# Altium schematic sheet imx8mnano_power.SchDoc
size A3; SheetNumber: 2; SheetTotal: 6
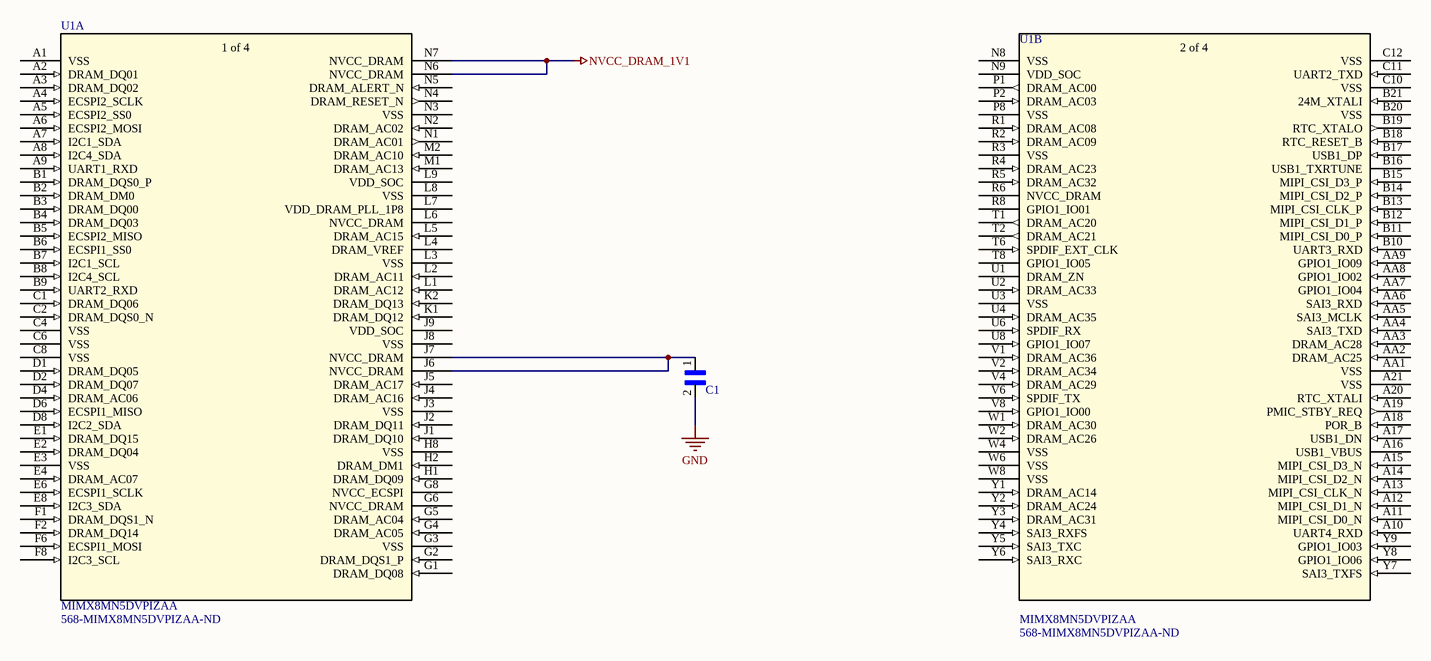
[diagram p0: imx8mnano_power.SchDoc]

## Parts
C1  CL05A106MQ5NUNC  [CL05A106MQ5NUNC]  (value not drawn)
U1  MIMX8MN5DVPIZAA  Supplier Part Number 1: 568-MIMX8MN5DVPIZAA-ND  [MIMX8MN5DVPIZAA_NXP]  (parts A,B of 4)

## Nets
GND: C1.2
NVCC_DRAM_1V1: U1.N6(NVCC_DRAM) U1.N7(NVCC_DRAM)
NetC1_1: C1.1 U1.J6(NVCC_DRAM) U1.J7(NVCC_DRAM)

Not connected (* = marked no-connect by the designer): U1 A1(VSS) A2(DRAM_DQ01) A3(DRAM_DQ02) A4(ECSPI2_SCLK) A5(ECSPI2_SS0) A6(ECSPI2_MOSI) A7(I2C1_SDA) A8(I2C4_SDA) A9(UART1_RXD) A10(UART4_RXD) A11(MIPI_CSI_D0_N) A12(MIPI_CSI_D1_N) A13(MIPI_CSI_CLK_N) A14(MIPI_CSI_D2_N) A15(MIPI_CSI_D3_N) A16(USB1_VBUS) A17(USB1_DN) A18(POR_B) A19(PMIC_STBY_REQ) A20(RTC_XTALI) A21(VSS) AA1(VSS) AA2(DRAM_AC25) AA3(DRAM_AC28) AA4(SAI3_TXD) AA5(SAI3_MCLK) AA6(SAI3_RXD) AA7(GPIO1_IO04) AA8(GPIO1_IO02) AA9(GPIO1_IO09) B1(DRAM_DQS0_P) B2(DRAM_DM0) B3(DRAM_DQ00) B4(DRAM_DQ03) B5(ECSPI2_MISO) B6(ECSPI1_SS0) B7(I2C1_SCL) B8(I2C4_SCL) B9(UART2_RXD) B10(UART3_RXD) B11(MIPI_CSI_D0_P) B12(MIPI_CSI_D1_P) B13(MIPI_CSI_CLK_P) B14(MIPI_CSI_D2_P) B15(MIPI_CSI_D3_P) B16(USB1_TXRTUNE) B17(USB1_DP) B18(RTC_RESET_B) B19(RTC_XTALO) B20(VSS) B21(24M_XTALI) C1(DRAM_DQ06) C2(DRAM_DQS0_N) C4(VSS) C6(VSS) C8(VSS) C10(VSS) C11(UART2_TXD) C12(VSS) D1(DRAM_DQ05) D2(DRAM_DQ07) D4(DRAM_AC06) D6(ECSPI1_MISO) D8(I2C2_SDA) E1(DRAM_DQ15) E2(DRAM_DQ04) E3(VSS) E4(DRAM_AC07) E6(ECSPI1_SCLK) E8(I2C3_SDA) F1(DRAM_DQS1_N) F2(DRAM_DQ14) F6(ECSPI1_MOSI) F8(I2C3_SCL) G1(DRAM_DQ08) G2(DRAM_DQS1_P) G3(VSS) G4(DRAM_AC05) G5(DRAM_AC04) G6(NVCC_DRAM) G8(NVCC_ECSPI) H1(DRAM_DQ09) H2(DRAM_DM1) H8(VSS) J1(DRAM_DQ10) J2(DRAM_DQ11) J3(VSS) J4(DRAM_AC16) J5(DRAM_AC17) J8(VSS) J9(VDD_SOC) K1(DRAM_DQ12) K2(DRAM_DQ13) L1(DRAM_AC12) L2(DRAM_AC11) L3(VSS) L4(DRAM_VREF) L5(DRAM_AC15) L6(NVCC_DRAM) L7(VDD_DRAM_PLL_1P8) L8(VSS) L9(VDD_SOC) M1(DRAM_AC13) M2(DRAM_AC10) N1(DRAM_AC01) N2(DRAM_AC02) N3(VSS) N4(DRAM_RESET_N) N5(DRAM_ALERT_N) N8(VSS) N9(VDD_SOC) P1(DRAM_AC00) P2(DRAM_AC03) P8(VSS) R1(DRAM_AC08) R2(DRAM_AC09) R3(VSS) R4(DRAM_AC23) R5(DRAM_AC32) R6(NVCC_DRAM) R8(GPIO1_IO01) T1(DRAM_AC20) T2(DRAM_AC21) T6(SPDIF_EXT_CLK) T8(GPIO1_IO05) U1(DRAM_ZN) U2(DRAM_AC33) U3(VSS) U4(DRAM_AC35) U6(SPDIF_RX) U8(GPIO1_IO07) V1(DRAM_AC36) V2(DRAM_AC34) V4(DRAM_AC29) V6(SPDIF_TX) V8(GPIO1_IO00) W1(DRAM_AC30) W2(DRAM_AC26) W4(VSS) W6(VSS) W8(VSS) Y1(DRAM_AC14) Y2(DRAM_AC24) Y3(DRAM_AC31) Y4(SAI3_RXFS) Y5(SAI3_TXC) Y6(SAI3_RXC) Y7(SAI3_TXFS) Y8(GPIO1_IO06) Y9(GPIO1_IO03)

## Notes on the sheet
- (in symbol MIMX8MN5DVPIZAA, part A) 1 of 4
- (in symbol MIMX8MN5DVPIZAA, part B) 2 of 4

## Library data of the parts
C1 = CL05A106MQ5NUNC: Multilayer Ceramic Capacitor, 10 uF, 6.3 V, ï¿½ 20%, X5R, 0402 [1005 Metric]; Manufacturer: Samsung; Capacitance: 10uF; Voltage Rating: 6.3V; Supplier 1: Avnet; Manufacturer Part Number: CL05A106MQ5NUNC; RoHS: Yes; Category: Ceramic Capacitors; Stock 1: 540000; Pricing 1: 10000=0.02499, 20000=0.02486, 40000=0.02474, 60000=0.02461, 80000=0.02448 (USD); Mount: Surface Mount; Case/Package: 0402; Case Code (Metric): 1005; Case Code (Imperial): 0402; Min Operating Temperature: -55°C; Max Operating Temperature: 85°C; Packaging: Tape and Reel; Tolerance: 20%; Package Quantity: 1; Dielectric: X5R; Series: CL; Construction: Flat; Length: 1mm; Width: 0.02inch; Height: 0.5mm; Thickness: 0.028inch; Depth: 0.5mm; Radiation Hardening: No; RoHS Compliant: Yes; ComponentLink1URL: https://datasheet.ciiva.com/16437/cl05a106mq5nunc-16437356.pdf?src-supplier=Future+Electronics; ComponentLink1Description: https://datasheet.ciiva.com/16437/cl05a106mq5nunc-16437356.pdf?src-supplier=Future+Electronics; ComponentLink2URL: https://datasheet.ciiva.com/26877/getdatasheetpartid-355289-26877841.pdf?src-supplier=Verical; ComponentLink2Description: https://datasheet.ciiva.com/26877/getdatasheetpartid-355289-26877841.pdf?src-supplier=Verical; Supplier Part Number 1: CL05A106MQ5NUNC
U1 = MIMX8MN5DVPIZAA: I.mx 8M Nano Ultralite, Tray Multiple Dp Bakeable, Tray Rohs Compliant: Yes; Manufacturer: NXP Semiconductors; Supplier 1: Digikey; Manufacturer Part Number: MIMX8MN5DVPIZAA; RoHS: Yes; Category: Microprocessors; Stock 1: 138; Pricing 1: 1=24.94, 10=20.041, 25=18.818, 168=17.09119, 336=16.65952, 504=16.44345 (USD)